# Altium schematic sheet afstandsbediening_main_IO.SchDoc
size A
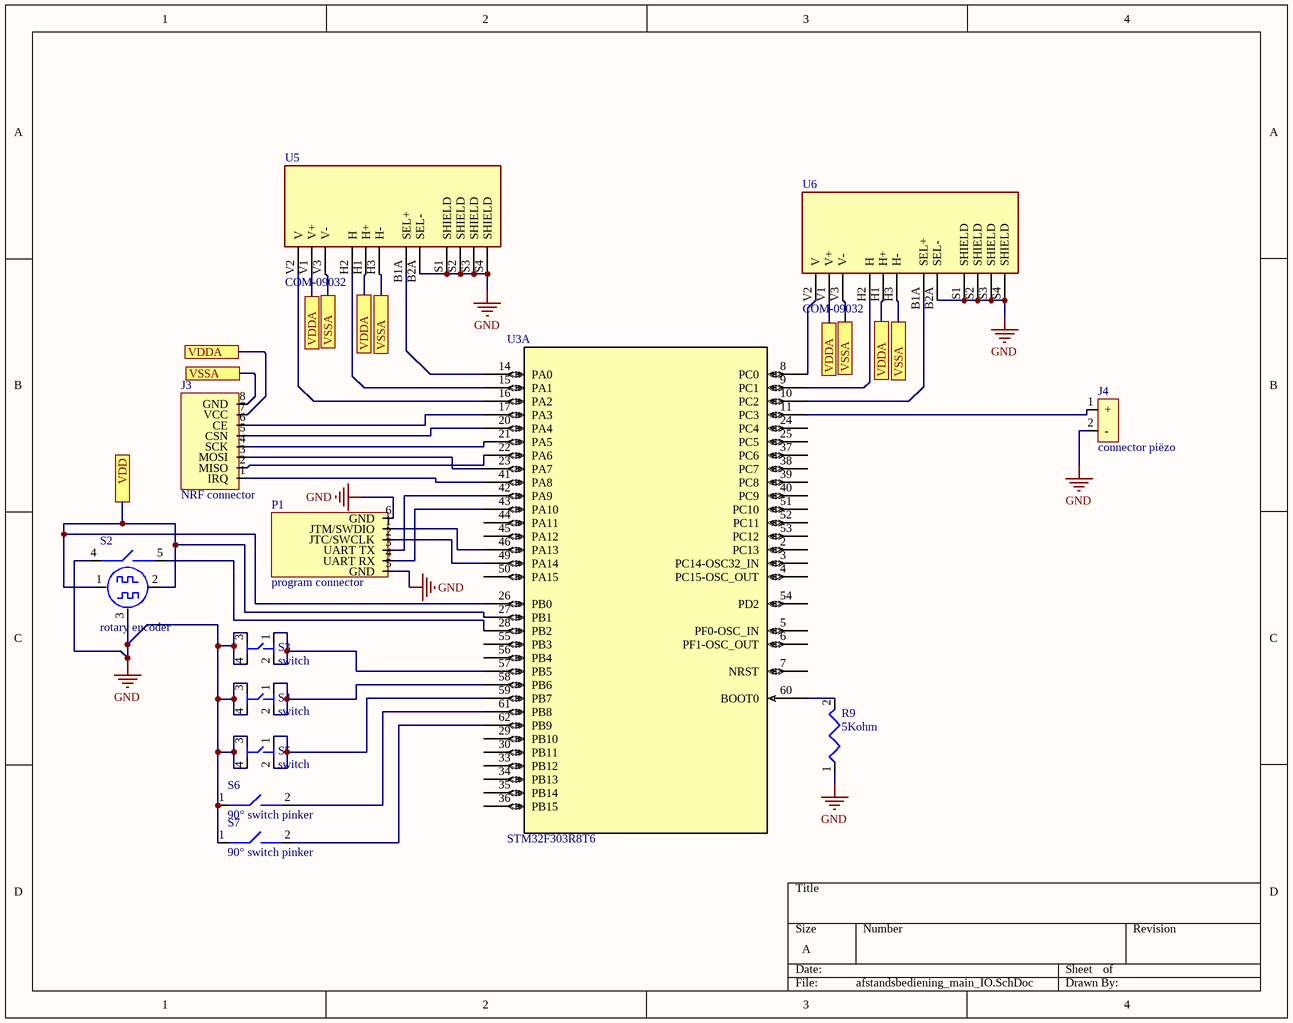
[diagram p0: afstandsbediening_main_IO.SchDoc]

## Parts
J3  NRF connector  [8 pin RF]
J4  connector piëzo  [M20-9770246 - duplicate]
P1  program connector  [M20-9980345]
R9  5Kohm  [ERJ-2RK]
S2  rotary encoder  [EC11E15244B2]
S3  switch  [B3F-1070]
S4  switch  [B3F-1070]
S5  switch  [B3F-1070]
S6  90° switch pinker  [B3F-3120 - duplicate]
S7  90° switch pinker  [B3F-3120 - duplicate]
U3  STM32F303R8T6  [LQFP64-10x10mm]  (part A of 2)
U5  COM-09032  [XDCR_COM-09032]
U6  COM-09032  [XDCR_COM-09032]

## Ports
VDD, VDDA, VSSA

## Nets
GND: J4.2(-) P1.5(GND) P1.6(GND) R9.1 S2.3 S2.4 S3.3 S3.4 S4.3 S4.4 S5.3 S5.4 S6.1 S7.1 U5.B2A(SEL-) U5.S1(SHIELD) U5.S2(SHIELD) U5.S3(SHIELD) U5.S4(SHIELD) U6.B2A(SEL-) U6.S1(SHIELD) U6.S2(SHIELD) U6.S3(SHIELD) U6.S4(SHIELD)
VDD: S2.1 S2.2 U3.26(PB0) U3.27(PB1) ; port VDD
VDDA: J3.7(VCC) U5.H1(H+) U5.V1(V+) U6.H1(H+) U6.V1(V+) ; port VDDA
VSSA: J3.8(GND) U5.H3(H-) U5.V3(V-) U6.H3(H-) U6.V3(V-) ; port VSSA
NetJ3_1: J3.1(IRQ) U3.41(PA8)
NetJ3_2: J3.2(MISO) U3.22(PA6)
NetJ3_3: J3.3(MOSI) U3.23(PA7)
NetJ3_4: J3.4(SCK) U3.21(PA5)
NetJ3_5: J3.5(CSN) U3.20(PA4)
NetJ3_6: J3.6(CE) U3.17(PA3)
NetJ4_1: J4.1(+) U3.11(PC3)
NetP1_1: P1.1(JTM/SWDIO) U3.46(PA13)
NetP1_2: P1.2(JTC/SWCLK) U3.49(PA14)
NetP1_3: P1.3(UART_TX) U3.42(PA9)
NetP1_4: P1.4(UART_RX) U3.43(PA10)
NetR9_2: R9.2 U3.60(BOOT0)
NetS2_5: S2.5 U3.28(PB2)
NetS3_1: S3.1 S3.2 U3.57(PB5)
NetS4_1: S4.1 S4.2 U3.58(PB6)
NetS5_1: S5.1 S5.2 U3.59(PB7)
NetS6_2: S6.2 U3.61(PB8)
NetS7_2: S7.2 U3.62(PB9)
NetU3_8: U3.8(PC0) U6.V2(V)
NetU3_9: U3.9(PC1) U6.H2(H)
NetU3_10: U3.10(PC2) U6.B1A(SEL+)
NetU3_14: U3.14(PA0) U5.B1A(SEL+)
NetU3_15: U3.15(PA1) U5.H2(H)
NetU3_16: U3.16(PA2) U5.V2(V)

Not connected (* = marked no-connect by the designer): U3 2(PC13) 3(PC14-OSC32_IN) 4(PC15-OSC_OUT) 5(PF0-OSC_IN) 6(PF1-OSC_OUT) 7(NRST) 24(PC4) 25(PC5) 29(PB10) 30(PB11) 33(PB12) 34(PB13) 35(PB14) 36(PB15) 37(PC6) 38(PC7) 39(PC8) 40(PC9) 44(PA11) 45(PA12) 50(PA15) 51(PC10) 52(PC11) 53(PC12) 54(PD2) 55(PB3) 56(PB4)

## Library data of the parts
J3 = 8 pin NRF
J4 = M20-9770246: Conn Unshrouded Header HDR 2 POS 2.54mm Solder ST Thru-Hole Bag; Manufacturer: Harwin; Number of Contacts: 2; Max Current Rating: 3A; Contact Resistance: 30mR; Voltage Rating: 750V; Connector Type: Male Pin; Supplier 1: Digi-Key; Manufacturer Part Number: M20-9770246; RoHS: Yes; Category: Headers and Wire Housings; Stock 1: 87004; Pricing 1: 1=0.12000, 10=0.10900, 25=0.08120, 50=0.06960, 250=0.05808, 750=0.05227, 1000=0.04878, 12000=0.03717, 24000=0.03368 (USD); Mount: Through Hole; Case/Package: SIL; Contact Plating: Tin; Contact Material: Brass; Color: Black; Housing Color: Black; Housing Material: Nylon; Min Operating Temperature: -40°C; Max Operating Temperature: 105°C; Number of Rows: 1; Termination: Solder; Package Quantity: 1000; Packaging: Bulk; Current Rating: 3A; Number of Positions: 2; Orientation: Straight; Series: M20; Contact Type: Male Pin; Length: 5.08mm; Pitch: 2.54mm; Contact Mating Length: 0.228inch; Depth: 2.54mm; Radiation Hardening: No; RoHS Compliant: Yes; ComponentLink1URL: https://datasheet.ciiva.com/26852/getdatasheetpartid-491110-26852182.pdf?src-supplier=Verical; ComponentLink1Description: https://datasheet.ciiva.com/26852/getdatasheetpartid-491110-26852182.pdf?src-supplier=Verical; ComponentLink2URL: https://datasheet.ciiva.com/5160/m20-977-5160312.pdf?src-supplier=Mouser; ComponentLink2Description: https://datasheet.ciiva.com/5160/m20-977-5160312.pdf?src-supplier=Mouser; Supplier Part Number 1: 952-1770-ND
P1 = M20-9980345: HARWIN - M20-9980345 - Board-To-Board Connector, Vertical, 2.54 mm, 6 Contacts, Header, M20 Series, Through Hole, 2 Rows; Number of Contacts: 6; Max Current Rating: 3A; Contact Resistance: 25mR; Gender: Male; Insulation Resistance: 10GR; Connector Type: Male Pin; Pitch: 2.54mm; Row Spacing: 0.1inch; Supplier 1: Digi-Key; Manufacturer: Harwin; Manufacturer Part Number: M20-9980345; RoHS: Yes; Category: Headers and Wire Housings; Stock 1: 24477; Pricing 1: 1=0.29000, 10=0.27300, 100=0.19110, 500=0.16380, 1000=0.13650, 5000=0.11700, 10000=0.10920 (USD); Mount: Through Hole; Contact Plating: Gold; Contact Material: Brass,Bronze; Color: Black; Weight: 0.125lb; Housing Color: Black; Housing Material: Nylon; Insulation Material: Polyester; Min Operating Temperature: -40°C; Max Operating Temperature: 105°C; Number of Rows: 2; Termination: Solder; Package Quantity: 1000; Current Rating: 3A; Packaging: Bag; Number of Positions: 6; Orientation: Straight; Series: M20; Contact Type: Male Pin; Length: 7.62mm; Width: 0.25inch; Height: 0.125inch; Contact Mating Length: 0.24inch; Depth: 5.08mm; Radiation Hardening: No; REACH SVHC: No SVHC; RoHS Compliant: Yes; ComponentLink1URL: https://datasheet.ciiva.com/6789/91635-6789923.pdf?src-supplier=Newark; ComponentLink1Description: https://datasheet.ciiva.com/6789/91635-6789923.pdf?src-supplier=Newark; ComponentLink2URL: https://datasheet.ciiva.com/11746/0900766b80da602b-11746662.pdf?src-supplier=RSComponents; ComponentLink2Description: https://datasheet.ciiva.com/11746/0900766b80da602b-11746662.pdf?src-supplier=RSComponents; ComponentLink3URL: https://datasheet.ciiva.com/26852/getdatasheetpartid-420465-26852189.pdf?src-supplier=Verical; ComponentLink3Description: https://datasheet.ciiva.com/26852/getdatasheetpartid-420465-26852189.pdf?src-supplier=Verical; ComponentLink4URL: https://datasheet.ciiva.com/6830/m20-998-6830775.pdf?src-supplier=Digi-Key; ComponentLink4Description: https://datasheet.ciiva.com/6830/m20-998-6830775.pdf?src-supplier=Digi-Key; ComponentLink5URL: https://datasheet.ciiva.com/8046/112195-8046904.pdf?src-supplier=Element14; ComponentLink5Description: https://datasheet.ciiva.com/8046/112195-8046904.pdf?src-supplier=Element14; Supplier Part Number 1: 952-2120-ND
R9 = ERJ-2RKF4991X: Res Thick Film 0402 4.99K Ohm 1% 1/10W +/-100ppm/ßC Molded SMD Punched Carrier T/R; Manufacturer: Panasonic; Resistance: 4.99kR; Power Rating: 100mW; Voltage Rating: 50V; Temperature Coefficient: 100ppm/°C; Supplier 1: Farnell; Manufacturer Part Number: ERJ-2RKF4991X; RoHS: Yes; Category: Chip SMD Resistors; Stock 1: 164767; Pricing 1: 10=0.01960, 100=0.00930, 500=0.00630, 2500=0.00570, 5000=0.00530, 10000=0.00490, 50000=0.00440 (EUR); Mount: Surface Mount; Case/Package: 0402; Case Code (Metric): 1005; Case Code (Imperial): 0402; Weight: 2.8E-05oz; Contact Plating: Tin; Min Operating Temperature: -55°C; Max Operating Temperature: 155°C; Tolerance: 1%; Packaging: Tape and Reel; Package Quantity: 1; Resistor Type: Thick Film; Number of Terminations: 2; Termination: SMD/SMT; Max Power Dissipation: 100mW; Voltage Rating (DC): 50V; Working Voltage: 50V; Features: Automotive AEC-Q200; Series: ERJ; Resistance Tolerance: 1%; Technology: THICK FILM; Construction: Rectangular; Length: 1mm; Width: 0.02inch; Height: 0.016inch; Depth: 0.5mm; Radiation Hardening: No; REACH SVHC: No SVHC; Military Standard: Not; Lead Free: Lead Free; RoHS Compliant: Yes; ComponentLink1URL: https://datasheet.ciiva.com/16773/70260748-16773110.pdf?src-supplier=Allied+Electronics; ComponentLink1Description: https://datasheet.ciiva.com/16773/70260748-16773110.pdf?src-supplier=Allied+Electronics; ComponentLink2URL: https://datasheet.ciiva.com/22749/1678782-22749654.pdf?src-supplier=Element14; ComponentLink2Description: https://datasheet.ciiva.com/22749/1678782-22749654.pdf?src-supplier=Element14; ComponentLink3URL: https://datasheet.ciiva.com/24158/aoa0000ce2-24158871.pdf?src-supplier=Mouser; ComponentLink3Description: https://datasheet.ciiva.com/24158/aoa0000ce2-24158871.pdf?src-supplier=Mouser; ComponentLink4URL: https://datasheet.ciiva.com/46388/426256-46388311.pdf?src-supplier=Element14; ComponentLink4Description: https://datasheet.ciiva.com/46388/426256-46388311.pdf?src-supplier=Element14; ComponentLink5URL: https://datasheet.ciiva.com/16199/aoa0000ce2-16199546.pdf?src-supplier=Future+Electronics; ComponentLink5Description: https://datasheet.ciiva.com/16199/aoa0000ce2-16199546.pdf?src-supplier=Future+Electronics; ComponentLink6URL: https://datasheet.ciiva.com/16775/70260748-16775018.pdf?src-supplier=Allied+Electronics; ComponentLink6Description: https://datasheet.ciiva.com/16775/70260748-16775018.pdf?src-supplier=Allied+Electronics; ComponentLink7URL: https://datasheet.ciiva.com/46376/426256-46376955.pdf?src-supplier=Element14; ComponentLink7Description: https://datasheet.ciiva.com/46376/426256-46376955.pdf?src-supplier=Element14; ComponentLink8URL: https://datasheet.ciiva.com/48530/aoa0000ce2-48530971.pdf?src-supplier=Avnet; ComponentLink8Description: https://datasheet.ciiva.com/48530/aoa0000ce2-48530971.pdf?src-supplier=Avnet; Supplier Part Number 1: 2059145
S2 = EC11E15244B2: ALPS - EC11E15244B2 - ENCODER, VERTICAL, 11MM, 30DET,15PPR; Manufacturer: Alps Electric; Number of Channels: 2; Nominal Supply Voltage (DC): 5V; Pulses per Revolution: 15; Built in Switch: Yes; Hole Diameter: 1.5mm; Supplier 1: Farnell; Manufacturer Part Number: EC11E15244B2; RoHS: Yes; Category: Encoders; Stock 1: 1927; Pricing 1: 1=4.11000, 5=3.45000, 10=3.19000, 20=2.97000, 50=2.83000 (EUR); Mount: Through Hole; Case/Package: Metal; Number of Pins: 5; Min Operating Temperature: -40°C; Max Operating Temperature: 85°C; Packaging: Tray; Package Quantity: 1200; Termination: Through Hole; Max Supply Voltage (AC): 5V; Radiation Hardening: No; RoHS Compliant: Yes; ComponentLink1URL: https://datasheet.ciiva.com/11807/0900766b80f4c221-11807911.pdf?src-supplier=RSComponents; ComponentLink1Description: https://datasheet.ciiva.com/11807/0900766b80f4c221-11807911.pdf?src-supplier=RSComponents; ComponentLink2URL: https://datasheet.ciiva.com/18154/getdatasheetpartid-652491-18154142.pdf?src-supplier=Verical; ComponentLink2Description: https://datasheet.ciiva.com/18154/getdatasheetpartid-652491-18154142.pdf?src-supplier=Verical; ComponentLink3URL: https://datasheet.ciiva.com/1310/1702859-1310642.pdf?src-supplier=Element14; ComponentLink3Description: https://datasheet.ciiva.com/1310/1702859-1310642.pdf?src-supplier=Element14; Supplier Part Number 1: 2064991
S3-S5 = B3F-1070: Switch Tactile N.O. SPST Flat Plunger PC Pins 0.05A 24VDC 0.98N Thru-Hole Bag; Manufacturer: Omron; Mechanical Life: 500000Cycles; Actuator Color: Black; Illumination Type: Non-Illuminated,Illuminated; Max Current Rating: 50mA; Voltage Rating (DC): 24V; Contact Resistance: 100mR; Electrical Life: 1000000Cycles; Number of Poles: 1; Switch Travel: 0.25mm; Switch Function: Off-Mom; Actuator Type: Standard; Actuator Length: 6.1mm; Supplier 1: Farnell; Manufacturer Part Number: B3F-1070; RoHS: Yes; Category: Tactile Switches; Stock 1: 5378; Pricing 1: 10=0.28600, 50=0.25600, 100=0.22600, 500=0.20900 (EUR); Mount: Through Hole; Contact Plating: Silver,Gold; Weight: 0.25g; Contact Material: Gold,Silver; Min Operating Temperature: -25°C; Max Operating Temperature: 70°C; Package Quantity: 1000; Packaging: Bulk; Series: B3F; Throw Configuration: SPST; Operating Force: 0.98N; Max Voltage Rating (DC): 24V; Current Rating: 50mA; Contact Current Rating: 50mA; Termination: PC Pins; Orientation: Straight; Insulation Resistance: 100MR; Length: 6mm; Depth: 7.7mm; REACH SVHC: Unknown; Lead Free: Lead Free; RoHS Compliant: Yes; ComponentLink1URL: https://datasheet.ciiva.com/14540/70175474-14540918.pdf?src-supplier=Allied+Electronics; ComponentLink1Description: https://datasheet.ciiva.com/14540/70175474-14540918.pdf?src-supplier=Allied+Electronics; ComponentLink2URL: https://datasheet.ciiva.com/2899/en-b3f-2899915.pdf?src-supplier=Digi-Key; ComponentLink2Description: https://datasheet.ciiva.com/2899/en-b3f-2899915.pdf?src-supplier=Digi-Key; ComponentLink3URL: https://datasheet.ciiva.com/14142/b3f-eng-datasheet-14142459.pdf?src-supplier=Distrelec; ComponentLink3Description: https://datasheet.ciiva.com/14142/b3f-eng-datasheet-14142459.pdf?src-supplier=Distrelec; ComponentLink4URL: https://datasheet.ciiva.com/26827/getdatasheetpartid-388866-26827340.pdf?src-supplier=Verical; ComponentLink4Description: https://datasheet.ciiva.com/26827/getdatasheetpartid-388866-26827340.pdf?src-supplier=Verical; ComponentLink5URL: https://datasheet.ciiva.com/20148/78-0136-20148405.pdf?src-supplier=Rapid+Electronics; ComponentLink5Description: https://datasheet.ciiva.com/20148/78-0136-20148405.pdf?src-supplier=Rapid+Electronics; ComponentLink6URL: https://datasheet.ciiva.com/16154/en-b3f-16154903.pdf?src-supplier=Onlinecomponents.com; ComponentLink6Description: https://datasheet.ciiva.com/16154/en-b3f-16154903.pdf?src-supplier=Onlinecomponents.com; ComponentLink7URL: https://datasheet.ciiva.com/5283/b3f-0811-26083-5283693.pdf?src-supplier=Mouser; ComponentLink7Description: https://datasheet.ciiva.com/5283/b3f-0811-26083-5283693.pdf?src-supplier=Mouser; ComponentLink8URL: https://datasheet.ciiva.com/15183/getdatasheetpartid-153449-15183757.pdf?src-supplier=Verical; ComponentLink8Description: https://datasheet.ciiva.com/15183/getdatasheetpartid-153449-15183757.pdf?src-supplier=Verical; Supplier Part Number 1: 959698
S6 S7 = B3F-3120: OMRON ELECTRONIC COMPONENTS         B3F3120            Tactile Switch, Non Illuminated, 0.98 N, 24 V, 50 mA, Solder, B3F Series; Mechanical Life: 1000000Cycles; Actuator Color: Black; Contact Current Rating: 50mA; Operating Force: 0.98N; Voltage Rating (DC): 24V; Throw Configuration: SPST; Contact Resistance: 100mR; Illumination Type: Non-Illuminated,Illuminated; Number of Poles: 1; Switch Travel: 0.25mm; Switch Function: Off-Mom; Actuator Type: Standard; Actuator Length: 1.6mm; Ratings: IP00; Supplier 1: Farnell; Manufacturer: Omron; Manufacturer Part Number: B3F-3120; RoHS: Yes; Category: Keylock Switches; Stock 1: 145; Pricing 1: 10=0.35800, 50=0.32000, 100=0.28200, 500=0.26300 (EUR); Mount: Through Hole; Contact Material: Gold,Silver; Contact Plating: Gold; Weight: 0.25g; Min Operating Temperature: -25°C; Max Operating Temperature: 70°C; Current Rating: 50mA; Package Quantity: 1000; Packaging: Bulk; Max Voltage Rating (DC): 24V; Max Current Rating: 50mA; Termination: PC Pins; Electrical Life: 1000000Cycles; Orientation: Right Angle; Series: B3F; Contact Type: 1 maker; Length: 7.3mm; Width: 6mm; Height: 3.85mm; Depth: 7.15mm; Radiation Hardening: No; REACH SVHC: Unknown; Lead Free: Lead Free; RoHS Compliant: Yes; ComponentLink1URL: https://datasheet.ciiva.com/26883/getdatasheetpartid-569160-26883377.pdf?src-supplier=Verical; ComponentLink1Description: https://datasheet.ciiva.com/26883/getdatasheetpartid-569160-26883377.pdf?src-supplier=Verical; ComponentLink2URL: https://datasheet.ciiva.com/2900/b3f-0811-2900017.pdf?src-supplier=Digi-Key; ComponentLink2Description: https://datasheet.ciiva.com/2900/b3f-0811-2900017.pdf?src-supplier=Digi-Key; ComponentLink3URL: https://datasheet.ciiva.com/30263/en-b3f-30263926.pdf?src-supplier=Onlinecomponents.com; ComponentLink3Description: https://datasheet.ciiva.com/30263/en-b3f-30263926.pdf?src-supplier=Onlinecomponents.com; ComponentLink4URL: https://datasheet.ciiva.com/48509/b3f-48509416.pdf?src-supplier=Distrelec; ComponentLink4Description: https://datasheet.ciiva.com/48509/b3f-48509416.pdf?src-supplier=Distrelec; ComponentLink5URL: https://datasheet.ciiva.com/16154/en-b3f-16154921.pdf?src-supplier=Onlinecomponents.com; ComponentLink5Description: https://datasheet.ciiva.com/16154/en-b3f-16154921.pdf?src-supplier=Onlinecomponents.com; ComponentLink6URL: https://datasheet.ciiva.com/15183/getdatasheetpartid-153427-15183754.pdf?src-supplier=Verical; ComponentLink6Description: https://datasheet.ciiva.com/15183/getdatasheetpartid-153427-15183754.pdf?src-supplier=Verical; ComponentLink7URL: https://datasheet.ciiva.com/1532/611570-1532588.pdf?src-supplier=Element14; ComponentLink7Description: https://datasheet.ciiva.com/1532/611570-1532588.pdf?src-supplier=Element14; ComponentLink8URL: https://datasheet.ciiva.com/16859/70175475-16859533.pdf?src-supplier=Allied+Electronics; ComponentLink8Description: https://datasheet.ciiva.com/16859/70175475-16859533.pdf?src-supplier=Allied+Electronics; Supplier Part Number 1: 1608275
U3 = STM32F303R8T6: No Description Available; Vendor: STMicroelectronics; Built_By: EMA_UL_Team; SourceLibrary: Updates_to_database_2020-10-19; Manufacturer_Part_Number: STM32F303R8T6; Copyright: Copyright (C) 2018 Accelerated Designs. All rights reserved; RefDes: RefDes; Type: DEV
U5 U6 = COM-09032: Joystick, 2 - Axis Analog _Resistive_ Output; MF: SparkFun Electronics; SnapEDA_Link: https://www.snapeda.com/parts/COM-09032/SparkFun%20Electronics/view-part/888157/?ref=snap; Availability: Unavailable; Value: *; Price: None; MP: COM-09032; Package: SparkFun Electronics